# EAGLE schematic protoLoadHighResolutionSchematic (EAGLE 6.4)
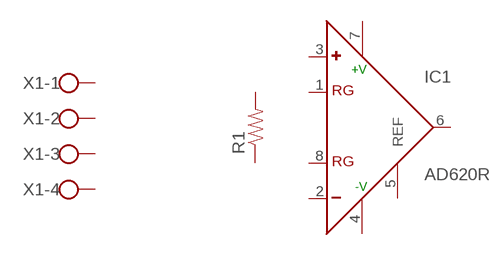
[diagram p0: schematic, sheet 1]

## Parts
IC1  AD620R  [SO8]
R1  RESISTORPTH-1/4W  [AXIAL-0.4]
X1  W237-4  [W237-4]
Unconnected: IC1.1(RG) IC1.2(-) IC1.3(+) IC1.5(REF) IC1.6(OUT) IC1.8(RG) R1.P$1 R1.P$2 X1.1 X1.2 X1.3 X1.4

## Power pins joined to a net without a drawn wire
+V: IC1.7(+V)
-V: IC1.4(-V)

## Library data of the parts
IC1 = analog-devices:AD620: Low Cost, Low Power, Instrumentation Amplifier Source: http://www.analog.com/UploadedFiles/Data_Sheets/37793330023930AD620_e.pdf; MPN: AD620AR; OC_FARNELL: 1464424; OC_NEWARK: 05F7109
R1 = SparkFun-Resistors:RESISTOR: Resistor Basic schematic elements and footprints for 0603, 1206, and PTH resistors.
X1 = con-wago-500:W237-4: WAGO SCREW CLAMP; OC_FARNELL: unknown; OC_NEWARK: unknown